# Altium project LASERDRIVER.PrjPcb
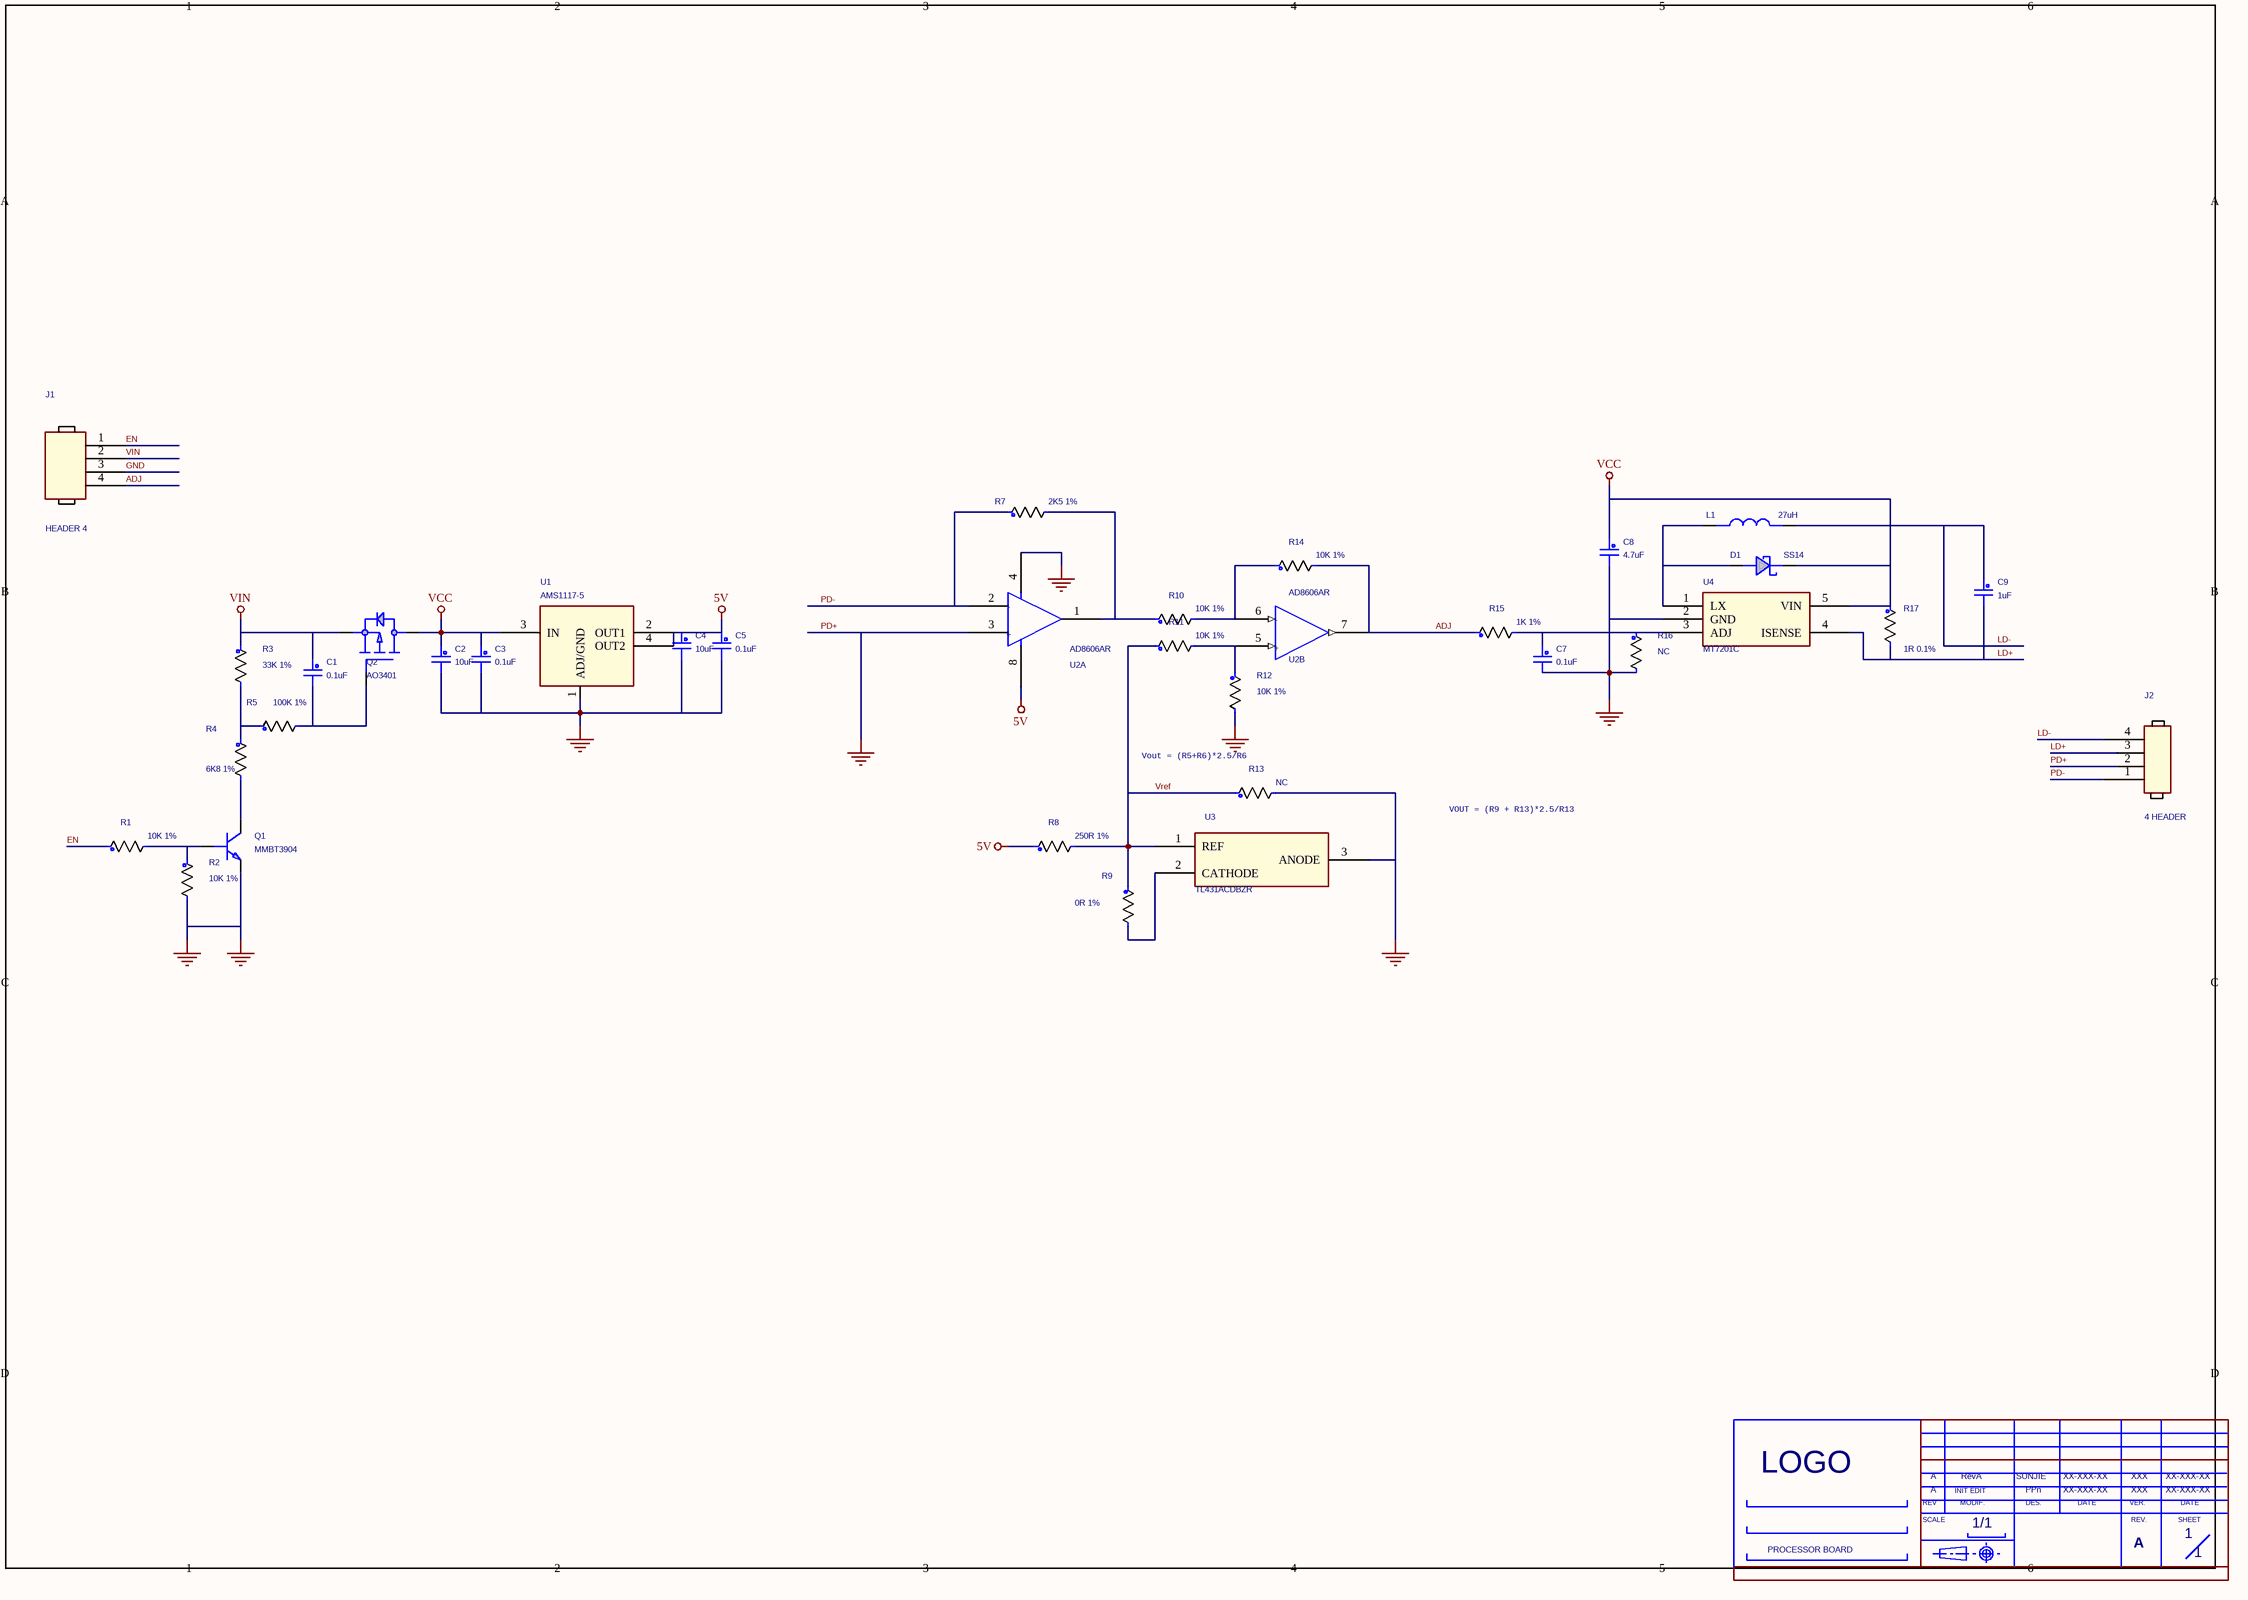
[diagram p0: PAGE1.SchDoc]
1 sheet, 35 parts. Net scope: global (net labels, ports and power ports of the same name join across sheets).

## Sheet PAGE1.SchDoc
size 420 x 297 mm

### Parts
*  DES B: SUNJIE  DES A: PPn  DATE B: XX-XXX-XX  Page Number: 1  REV: A  VERIF A: XXX  SHEET NAME 1: PROCESSOR BOARD  (hidden comment: MY CARTOUCHE)  (graphical)
C1  0.1uF  [CAP0805]
C2  10uF  [CAP0805]
C3  0.1uF  [CAP0805]
C4  10uF  [CAP0805]
C5  0.1uF  [CAP0805]
C7  0.1uF  [CAP0805]
C8  4.7uF  [CAP0805]
C9  1uF  [CAP0805]
D1  SS14  [sod-123]
J1  HEADER 4  [WAFER1X4-2_54MM]
J2  4 HEADER
L1  27uH  [L1008]
Q1  MMBT3904  [sot-23]
Q2  AO3401  [sot-23]
R1  10K 1%  [r0805]
R2  10K 1%  [r0805]
R3  33K 1%  [r0805]
R4  6K8 1%  [r0805]
R5  100K 1%  [r0805]
R7  2K5 1%  [r0805]
R8  250R 1%  [r0805]
R9  0R 1%  [r0805]
R10  10K 1%  [r0805]
R11  10K 1%  [r0805]
R12  10K 1%  [r0805]
R13  NC  [r0805]
R14  10K 1%  [r0805]
R15  1K 1%  [r0805]
R16  NC  [r0805]
R17  1R 0.1%  [r0805]
U1  AMS1117-5  [SOT223]
U2  AD8606AR  [sop8_244_0500_069]  (parts A,B of 2)
U3  TL431ACDBZR  [SOT-23-3]
U4  MT7201C  [sot89-5]

### Nets
5V: C4.1 C5.1 R8.1 U1.2(OUT1) U1.4(OUT2) U2.8(+VS)
GND: C2.2 C3.2 C4.2 C5.2 C7.2 C8.2 J1.3 J2.2 Q1.2 R2.2 R12.2 R13.2 R16.2 U1.1(ADJ/GND) U2.3(+IN1) U2.4(-VS) U3.3(ANODE) U4.2(GND)  [also labelled PD+]
VCC: C2.1 C3.1 C8.1 D1.1(ANODE) Q2.3(DRAIN) R17.1 U1.3(IN) U4.5(VIN)
VIN: C1.1 J1.2 Q2.2(SOURCE) R3.1
ADJ: J1.4 R14.2 R15.1 U2.7(OUT2)
EN: J1.1 R1.1
LD+: C9.2 J2.3 R17.2 U4.4(ISENSE)
LD-: C9.1 J2.4 L1.2
PD-: J2.1 R7.1 U2.2(-N1)
Vref: R8.2 R9.1 R11.1 R13.1 U3.1(REF)
NetC1_2: C1.2 Q2.1(GATE) R5.2
NetC7_1: C7.1 R15.2 R16.1 U4.3(ADJ)
NetD1_2: D1.2(CATHODE) L1.1 U4.1(LX)
NetQ1_1: Q1.1 R1.2 R2.1
NetQ1_3: Q1.3 R4.2
NetR3_2: R3.2 R4.1 R5.1
NetR7_2: R7.2 R10.1 U2.1(OUT1)
NetR9_2: R9.2 U3.2(CATHODE)
NetR10_2: R10.2 R14.1 U2.6(-IN2)
NetR11_2: R11.2 R12.1 U2.5(+IN2)

### Notes on the sheet
- Vout = (R5+R6)*2.5/R6
- VOUT = (R9 + R13)*2.5/R13
- (in symbol AD8032ARZ, part A) -; +
- (in symbol AD8032ARZ, part B) -; +
- (in symbol MY CARTOUCHE) LOGO; RevA; INIT EDIT; REV; MODIF.; DES.; DATE; VER.; SCALE; REV.; SHEET; 1/1

### Library data of the parts
* = MY CARTOUCHE: REV E: E; REV F: F; REV B: B; REV C: C; REV D: D; DES D: XXX; DES C: XXX; DES F: XXX; DES E: XXX; DATE F: XX-XXX-XX; DATE E: XX-XXX-XX; DATE D: XX-XXX-XX; DATE C: XX-XXX-XX; DATE A: XX-XXX-XX; Page Create Date: june 19, 2004; Page Size: A; Page Count: 1; FT: ?; VERIF DATE B: XX-XXX-XX; VERIF DATE C: XX-XXX-XX; VERIF DATE D: XX-XXX-XX; VERIF DATE E: XX-XXX-XX; VERIF DATE F: XX-XXX-XX; VERIF DATE A: XX-XXX-XX; VERIF B: XXX; VERIF C: XXX; VERIF D: XXX; VERIF E: XXX; VERIF F: XXX
C1 C5 = C_Generic: CAP - 0.1UF - +/-10% - X5R - 25V - SMD0805; DESIG: Ceramic Capacitor; FAB: Murata; Ref: GRM21BR61E475KA12L; Voltage: 25V; VAL: 0.1uF
C2 = C_Generic: CAP - 10UF - +/-10% - X5R - 25V - SMD0805; Ref: GRM21BR61E475KA12L; FAB: Murata; DESIG: Ceramic Capacitor; Voltage: 25V; VAL: 10uF
C3 C7 = C_Generic: CAP - 0.1UF - +/-10% - X5R - 25V - SMD0805; Ref: GRM21BR61E475KA12L; FAB: Murata; DESIG: Ceramic Capacitor; Voltage: 25V; VAL: 0.1uF
C4 = C_Generic: CAP - 10UF - +/-10% - X5R - 25V - SMD0805; DESIG: Ceramic Capacitor; FAB: Murata; Ref: GRM21BR61E475KA12L; Voltage: 25V; VAL: 10uF
C8 = C_Generic: CAP - 4.7UF - +/-10% - X5R - 25V - SMD0805; Ref: GRM21BR61E475KA12L; FAB: Murata; DESIG: Ceramic Capacitor; Voltage: 25V; VAL: 4.7uF
C9 = C_Generic: CAP - 1UF - +/-10% - X5R - 25V - SMD0805; DESIG: Ceramic Capacitor; FAB: Murata; Ref: GRM21BR61E475KA12L; Voltage: 25V; VAL: 1uF
D1 = DIODE SCHOTTKY_0: Schottky, 1.0 Ampere Schottky Barrier Rectifiers; FAB: DIODES; Ref: SS14; VAL: SS14
L1 = L_2.2uH-1.48A_CMS: Inductor - 47uH - Ir=1.3A - RF=40MHz - Rdc=100m ohm - SMD1008; FAB: Murata; REF: LQM2HPN2R2MG0L; I: 1.48A; DESIG: Inductor; VAL: 47uH; RoHS: YES
Q1 = NPN_0: -; FAB: DIODES; VAL: MMBT3904; Ref: MMBT3904
Q2 = TM3401: -; FAB: AOS; VAL: AO3401; Ref: AO3401
R1 R10-R12 R14 = R_Generic: RES - 10K - +/-1% - 1/8W - SMD0805; REF: RC0805FR-071KL; FAB: YAGEO; DESIG: Thick film Resistor; TOL: 1%; VAL: 10K 1%
R2 = R_Generic: RES - 10K - +/-1% - 1/8W - SMD0805; DESIG: Thick film Resistor; FAB: YAGEO; REF: RC0805FR-071KL; VAL: 10K 1%; TOL: 1%
R3 = R_Generic: RES - 33K - +/-1% - 1/8W - SMD0805; REF: RC0805FR-071KL; FAB: YAGEO; DESIG: Thick film Resistor; TOL: 1%; VAL: 33K 1%
R4 = R_Generic: RES - 6K8 - +/-1% - 1/8W - SMD0805; REF: RC0805FR-071KL; FAB: YAGEO; DESIG: Thick film Resistor; TOL: 1%; VAL: 6K8 1%
R5 = R_Generic: RES - 100K - +/-1% - 1/8W - SMD0805; DESIG: Thick film Resistor; FAB: YAGEO; REF: RC0805FR-071KL; VAL: 100K 1%; TOL: 1%
R7 = R_Generic: RES - 0R - +/-1% - 1/8W - SMD0805; DESIG: Thick film Resistor; FAB: YAGEO; REF: RC0805FR-071KL; VAL: 0R 1%; TOL: 1%
R8 = R_Generic: RES - 250R - +/-1% - 1/8W - SMD0805; REF: RC0805FR-071KL; FAB: YAGEO; DESIG: Thick film Resistor; TOL: 1%; VAL: 250R 1%
R9 = R_Generic: RES - 0R - +/-1% - 1/8W - SMD0805; DESIG: Thick film Resistor; FAB: YAGEO; REF: RC0805FR-071KL; VAL: 0R 1%; TOL: 1%
R13 = R_Generic: RES - 0R - +/-1% - 1/8W - SMD0805; DESIG: Thick film Resistor; FAB: YAGEO; REF: RC0805FR-071KL; TOL: 1%; VAL: NC
R15 = R_Generic: RES - 1K - +/-1% - 1/8W - SMD0805; REF: RC0805FR-071KL; FAB: YAGEO; DESIG: Thick film Resistor; TOL: 1%; VAL: 1K 1%
R16 = R_Generic: RES - 1M - +/-1% - 1/8W - SMD0805; DESIG: Thick film Resistor; FAB: YAGEO; REF: RC0805FR-071KL; VAL: 1M 1%; TOL: 1%
R17 = R_Generic: RES - 1R - +/-0.1% - 1/8W - SMD0805; DESIG: Thick film Resistor; FAB: YAGEO; REF: RC0805FR-071KL; VAL: 1R 0.1%; TOL: 0.1%
U1 = AS1117: -; Mfr_Name: AOS; Mfr_part_number: AMS1117-5
U2 = AD8032ARZ: Precision, Low Noise, CMOS, Rail-to-Rail,Input/Output Operational Amplifiers; FAB: ADI; VAL: AD8606AR; Ref: AD8606AR
U3 = TL431: TL43xx Precision Programmable Reference; FAB: TI; Ref: TL431ACDBZR; VAL: TL431ACDBZR
U4 = MT7201C: LED Driver; FAB: MAXIC; VAL: MT7201C; Ref: MT7201C
J1 = HEADER 4: VAL: HEADER 4; Ref: WAFER1X4-2_54MM